# EAGLE schematic Microkontroller (EAGLE 9.2.0)
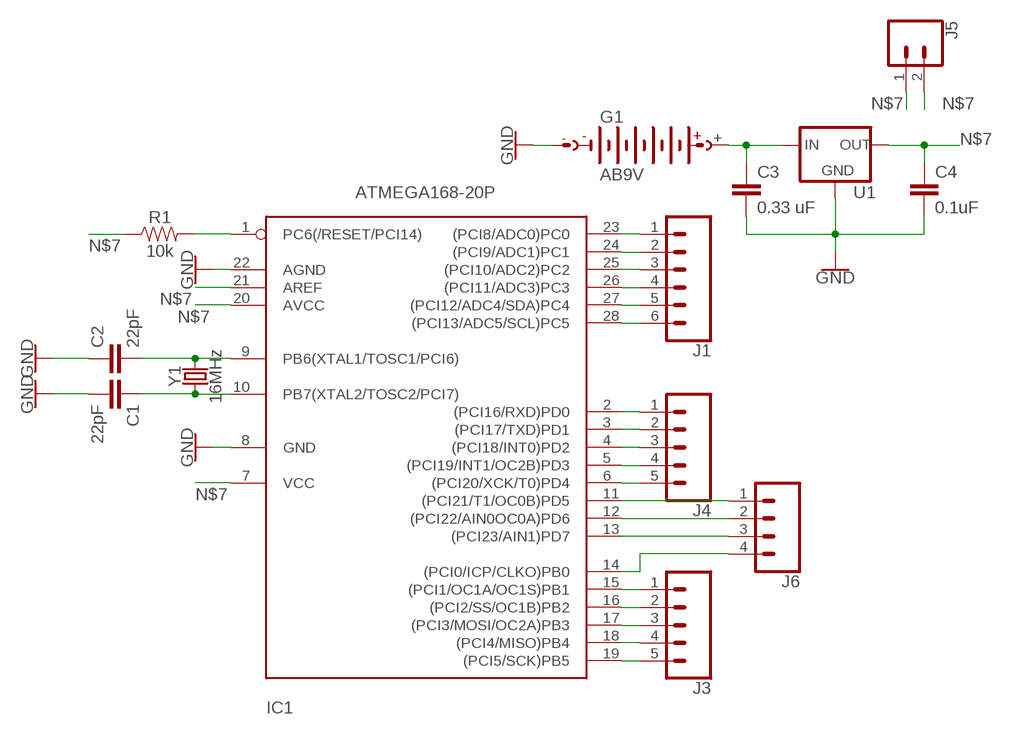
[diagram p0: schematic, sheet 1]

## Parts
C1  22pF  22PF-PTH-2.54MM-200V-5%  [CAP-PTH-2.54]
C2  22pF  22PF-PTH-2.54MM-200V-5%  [CAP-PTH-2.54]
C3  0.33 uF  C2.5/2  [C2.5-2]
C4  0.1uF  0.1UF-KIT-EZ-50V-20%  [CAP-PTH-SMALL-KIT]
G1  AB9V  [AB9V]
IC1  ATMEGA168-20P  [DIL28-3]
J1  CONN_06SILK_FEMALE_PTH  [1X06]
J3  CONN_05  [1X05]
J4  CONN_05  [1X05]
J5  CONN_02  [1X02]
J6  CONN_04  [1X04]
R1  10k  10KOHM-HORIZ-1/4W-1%  [AXIAL-0.3]
U1  V_REG_78XXSIDE  [78XXL]
Y1  16MHz  CRYSTAL-16MHZPTH-HC49US  [HC49US]

## Nets
GND: C1.2 C2.1 C3.2 C4.2 G1.- IC1.8(GND) IC1.22(AGND) U1.GND
N$1: IC1.13((PCI23/AIN1)PD7) J6.3
N$2: IC1.26((PCI11/ADC3)PC3) J1.4
N$3: IC1.27((PCI12/ADC4/SDA)PC4) J1.5
N$4: IC1.28((PCI13/ADC5/SCL)PC5) J1.6
N$5: C2.2 IC1.9(PB6(XTAL1/TOSC1/PCI6)) Y1.2
N$6: C1.1 IC1.10(PB7(XTAL2/TOSC2/PCI7)) Y1.1
N$7: C4.1 IC1.7(VCC) IC1.20(AVCC) IC1.21(AREF) J5.1 J5.2 R1.P$1 U1.OUT
N$8: IC1.1(PC6(/RESET/PCI14)) R1.P$2
N$9: C3.1 G1.+ U1.IN
N$10: IC1.3((PCI17/TXD)PD1) J4.2
N$11: IC1.2((PCI16/RXD)PD0) J4.1
N$12: IC1.12((PCI22/AIN0OC0A)PD6) J6.2
N$13: IC1.5((PCI19/INT1/OC2B)PD3) J4.4
N$14: IC1.6((PCI20/XCK/T0)PD4) J4.5
N$15: IC1.11((PCI21/T1/OC0B)PD5) J6.1
N$16: IC1.4((PCI18/INT0)PD2) J4.3
N$17: IC1.17((PCI3/MOSI/OC2A)PB3) J3.3
N$18: IC1.18((PCI4/MISO)PB4) J3.4
N$19: IC1.19((PCI5/SCK)PB5) J3.5
N$20: IC1.14((PCI0/ICP/CLKO)PB0) J6.4
N$21: IC1.15((PCI1/OC1A/OC1S)PB1) J3.1
N$22: IC1.16((PCI2/SS/OC1B)PB2) J3.2
N$23: IC1.25((PCI10/ADC2)PC2) J1.3
N$24: IC1.24((PCI9/ADC1)PC1) J1.2
N$25: IC1.23((PCI8/ADC0)PC0) J1.1

## Library data of the parts
C1 C2 = SparkFun-Capacitors:22PF: 22pF ceramic capacitors A capacitor is a passive two-terminal electrical component used to store electrical energy temporarily in an electric field.; PROD_ID: CAP-09128
C3 = capacitor-wima:C: CAPACITOR naming: grid - package width
C4 = SparkFun-Capacitors:0.1UF: 0.1µF ceramic capacitors A capacitor is a passive two-terminal electrical component used to store electrical energy temporarily in an electric field.; PROD_ID: CAP-08370
G1 = battery:AB9V: 9-V BATTERY CLIP
IC1 = adafruit:ATMEGA168*P: MICROCONTROLLER 16 kBytes FLASH 1 kBytes SRAM 512 Bytes EEPROM USART 8-channel 10 bit ADC
J1 = SparkFun-Connectors:CONN_06: Multi connection point. Often used as Generic Header-pin footprint for 0.1 inch spaced/style header connections On any of the 0.1 inch spaced packages, you can populate with these: Break Away Headers - Straight <https://www.sparkfun.com/products/116> (PRT-00116) Break Away Male Headers - Right Angle <https://www.sparkfun.com/products/553> (PRT-00553) Female Headers <https://www.sparkfun.com/products/115> (PRT-00115) Break Away Headers - Machine Pin <https://www.sparkfun.com/products/117> (PRT-00117) Break Away Female Headers - Swiss Machine Pin <https://www.sparkfun.com/products/743> (PRT-00743) Arduino Stackable Header - 6 Pin <https://www.sparkfun.com/products/9280> (PRT-09280) For SCREWTERMINALS and SPRING TERMINALS visit here: Screw Terimnals on SparkFun.com <https://www.sparkfun.com/search/results?term=Screw+Terminals> (5mm/3.5mm/2.54mm spacing) This device is also useful as a general connection point to wire up your design to another part of your project. Our various solder wires solder well into these plated through hole pads. Hook-Up Wire - Assortment (Stranded, 22 AWG) <https://www.sparkfun.com/products/11375> (PRT-11375) Hook-Up Wire - Assortment (Solid Core, 22 AWG) <https://www.sparkfun.com/products/11367> (PRT-11367) View the entire wire category on our website here <https://www.sparkfun.com/categories/141>; PROD_ID: CONN-08437
J3 J4 = SparkFun-Connectors:CONN_05: Multi connection point. Often used as Generic Header-pin footprint for 0.1 inch spaced/style header connections On any of the 0.1 inch spaced packages, you can populate with these: Break Away Headers - Straight <https://www.sparkfun.com/products/116> (PRT-00116) Break Away Male Headers - Right Angle <https://www.sparkfun.com/products/553> (PRT-00553) Female Headers <https://www.sparkfun.com/products/115> (PRT-00115) Break Away Headers - Machine Pin <https://www.sparkfun.com/products/117> (PRT-00117) Break Away Female Headers - Swiss Machine Pin <https://www.sparkfun.com/products/743> (PRT-00743) For SCREWTERMINALS and SPRING TERMINALS visit here: Screw Terimnals on SparkFun.com <https://www.sparkfun.com/search/results?term=Screw+Terminals> (5mm/3.5mm/2.54mm spacing) This device is also useful as a general connection point to wire up your design to another part of your project. Our various solder wires solder well into these plated through hole pads. Hook-Up Wire - Assortment (Stranded, 22 AWG) <https://www.sparkfun.com/products/11375> (PRT-11375) Hook-Up Wire - Assortment (Solid Core, 22 AWG) <https://www.sparkfun.com/products/11367> (PRT-11367) View the entire wire category on our website here <https://www.sparkfun.com/categories/141> Special notes: Molex polarized connector foot print use with SKU : PRT-08231 with associated crimp pins and housings. 1MM SMD Version SKU: PRT-10208
J5 = SparkFun-Connectors:CONN_02: Multi connection point. Often used as Generic Header-pin footprint for 0.1 inch spaced/style header connections On any of the 0.1 inch spaced packages, you can populate with these: Break Away Headers - Straight <https://www.sparkfun.com/products/116> (PRT-00116) Break Away Male Headers - Right Angle <https://www.sparkfun.com/products/553> (PRT-00553) Female Headers <https://www.sparkfun.com/products/115> (PRT-00115) Break Away Headers - Machine Pin <https://www.sparkfun.com/products/117> (PRT-00117) Break Away Female Headers - Swiss Machine Pin <https://www.sparkfun.com/products/743> (PRT-00743) For SCREWTERMINALS and SPRING TERMINALS visit here: Screw Terimnals on SparkFun.com <https://www.sparkfun.com/search/results?term=Screw+Terminals> (5mm/3.5mm/2.54mm spacing) This device is also useful as a general connection point to wire up your design to another part of your project. Our various solder wires solder well into these plated through hole pads. Hook-Up Wire - Assortment (Stranded, 22 AWG) <https://www.sparkfun.com/products/11375> (PRT-11375) Hook-Up Wire - Assortment (Solid Core, 22 AWG) <https://www.sparkfun.com/products/11367> (PRT-11367) View the entire wire category on our website here <https://www.sparkfun.com/categories/141> Special notes: Molex polarized connector foot print use with: PRT-08233 with associated crimp pins and housings. 2.54_SCREWTERM for use with PRT-10571. 3.5mm Screw Terminal footprints for PRT-08084 5mm Screw Terminal footprints for use with PRT-08432
J6 = SparkFun-Connectors:CONN_04: Multi connection point. Often used as Generic Header-pin footprint for 0.1 inch spaced/style header connections On any of the 0.1 inch spaced packages, you can populate with these: Break Away Headers - Straight <https://www.sparkfun.com/products/116> (PRT-00116) Break Away Male Headers - Right Angle <https://www.sparkfun.com/products/553> (PRT-00553) Female Headers <https://www.sparkfun.com/products/115> (PRT-00115) Break Away Headers - Machine Pin <https://www.sparkfun.com/products/117> (PRT-00117) Break Away Female Headers - Swiss Machine Pin <https://www.sparkfun.com/products/743> (PRT-00743) For SCREWTERMINALS and SPRING TERMINALS visit here: Screw Terimnals on SparkFun.com <https://www.sparkfun.com/search/results?term=Screw+Terminals> (5mm/3.5mm/2.54mm spacing) This device is also useful as a general connection point to wire up your design to another part of your project. Our various solder wires solder well into these plated through hole pads. Hook-Up Wire - Assortment (Stranded, 22 AWG) <https://www.sparkfun.com/products/11375> (PRT-11375) Hook-Up Wire - Assortment (Solid Core, 22 AWG) <https://www.sparkfun.com/products/11367> (PRT-11367) View the entire wire category on our website here <https://www.sparkfun.com/categories/141> Special notes: Molex polarized connector foot print use with SKU : PRT-08231 with associated crimp pins and housings. 1MM SMD Version SKU: PRT-10208; PROD_ID: CONN-09696
R1 = SparkFun-Resistors:10KOHM: 10kΩ resistor A resistor is a passive two-terminal electrical component that implements electrical resistance as a circuit element. Resistors act to reduce current flow, and, at the same time, act to lower voltage levels within circuits. - Wikipedia; PROD_ID: RES-12183
U1 = SparkFun-IC-Power:V_REG_78XX: Voltage Regulator Standard 78xx regulator. IGO (Input Ground Output). Spark Fun Electronics SKU : COM-00107
Y1 = SparkFun-Clocks:CRYSTAL-16MHZ: 16MHz Crystal Digikey Example <http://www.digikey.com/product-search/en?keywords=535-9122-1-ND> Frequency: 16MHz Frequency Stability: ±50ppm Frequency Tolerance: ±20ppm Load Capacitance: 18pF SparkFun Products: Pro Micro -5V/16MHz <https://www.sparkfun.com/products/12640> SparkFun Serial Enabled LCD Kit <https://www.sparkfun.com/products/10097>; PROD_ID: XTAL-08181; SF_ID: COM-00536

## Net classes
0 default: width 0.813 mm, drill 0.61 mm, clearance 0.61 mm